# EAGLE design SCS (EAGLE 7.2.0)
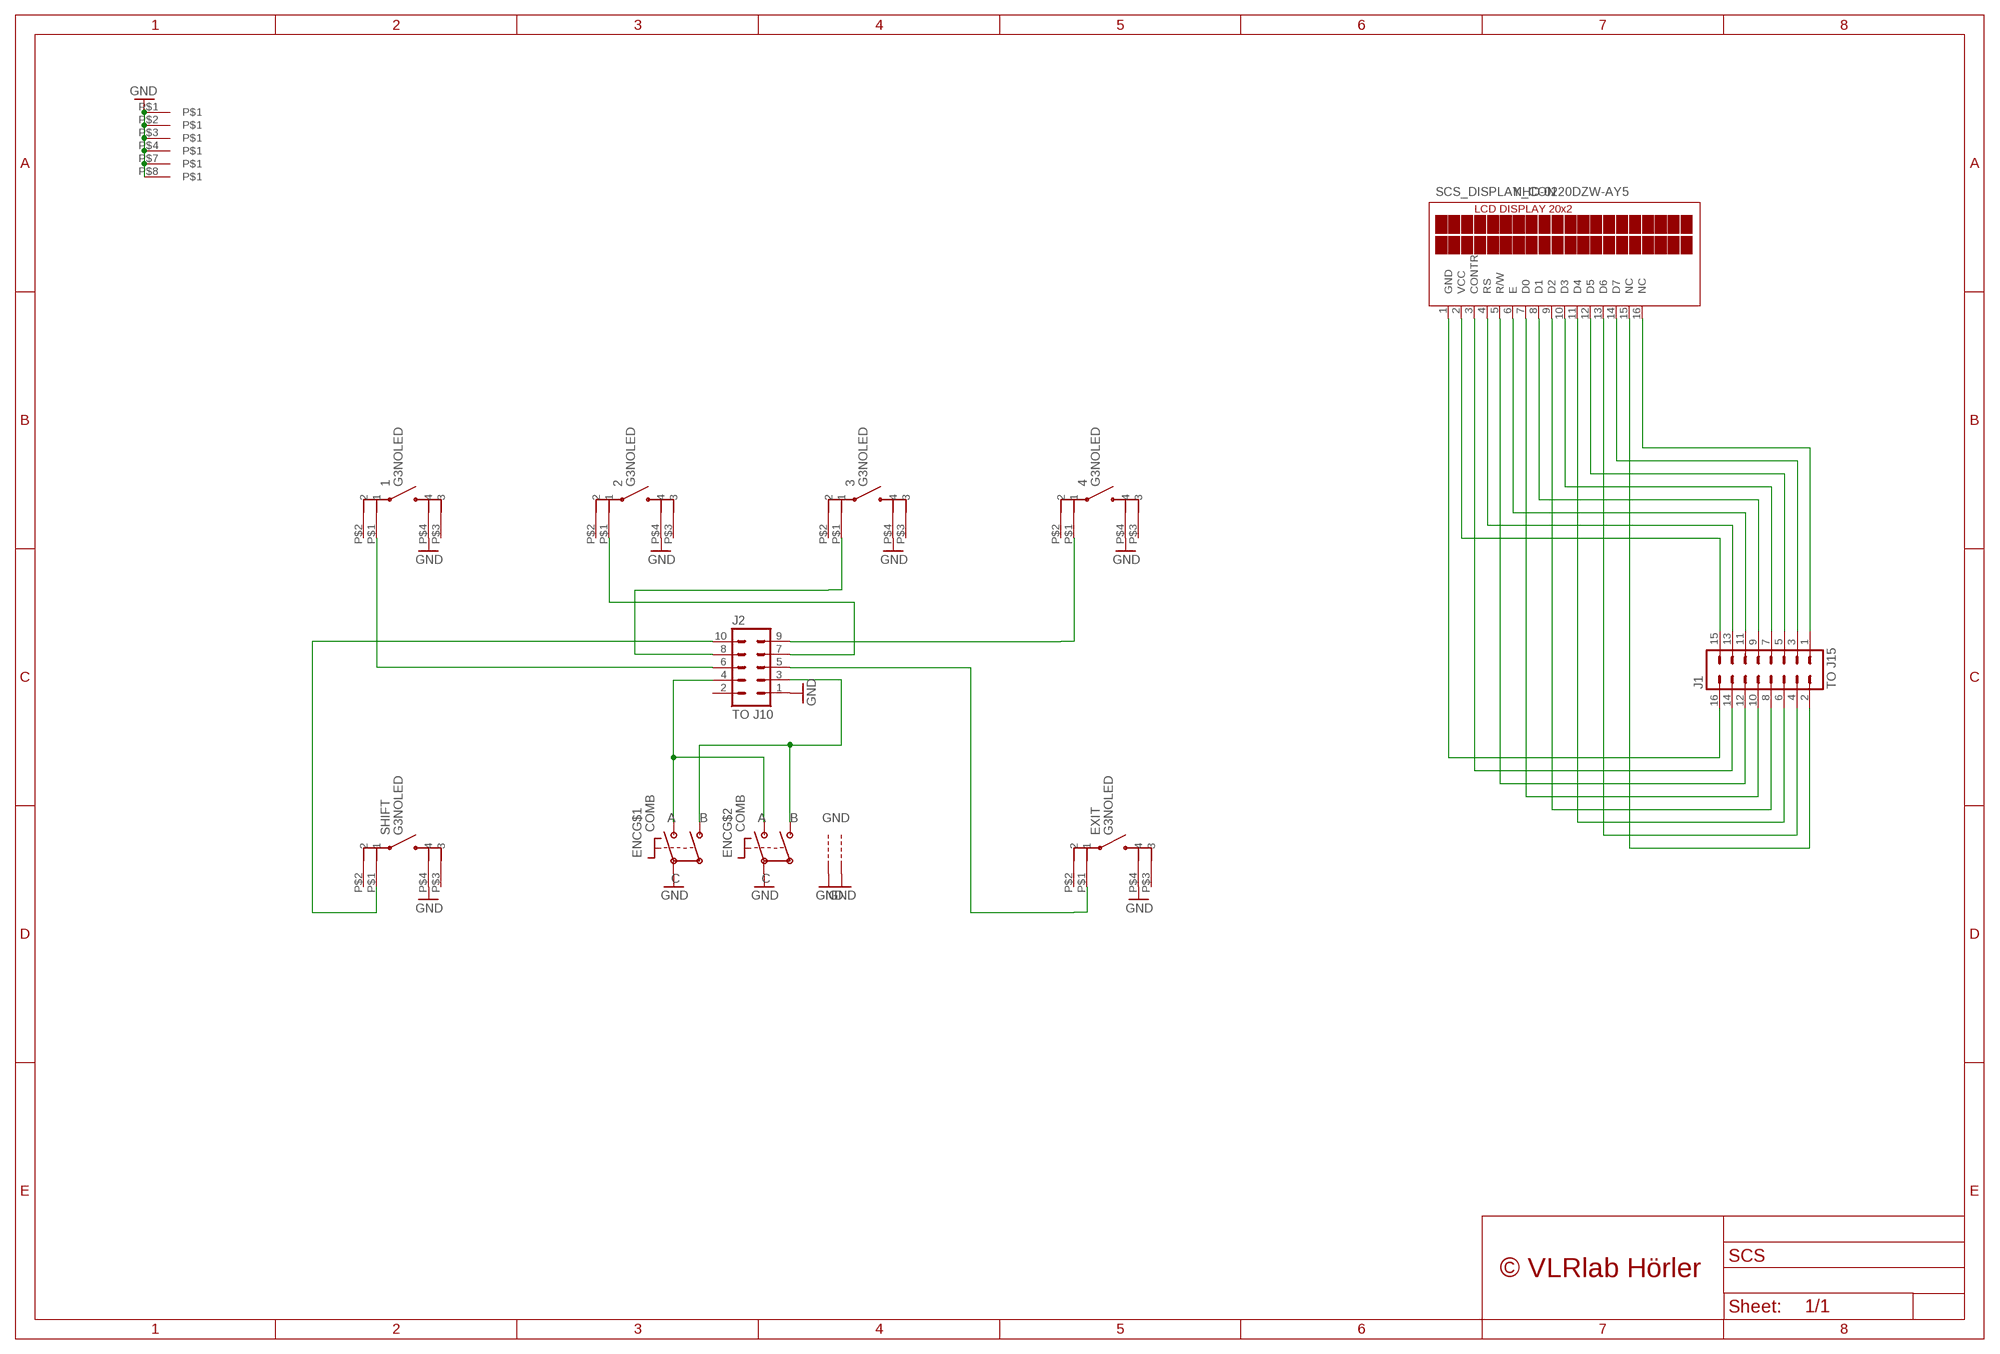
[diagram p0: schematic, sheet 1]

## Parts
1  G3NOLED  [G3NOLED]
2  G3NOLED  [G3NOLED]
3  G3NOLED  [G3NOLED]
4  G3NOLED  [G3NOLED]
ENC  COMB  [COMB_PEC11&STEC16]
EXIT  G3NOLED  [G3NOLED]
J1  TO J15  ML16  [ML16]
J2  TO J10  ML10  [ML10]
SCS_DISPLAY_CON  NHD-0220DZW-AY5  [NHD-0220DZW-AY5]
SHIFT  G3NOLED  [G3NOLED]
U$2  MIDIBOX_FULL  [MIDIBOX14X12]

## Nets
GND: 1.P$4 2.P$4 3.P$4 4.P$4 ENC.P$C ENC.P$C1(P$C) ENC.P$GND1 ENC.P$GND2 EXIT.P$4 J2.1 SHIFT.P$4 U$2.P$1 U$2.P$2 U$2.P$3 U$2.P$4 U$2.P$7 U$2.P$8
N$1: J1.16 SCS_DISPLAY_CON.1(GND)
N$2: J1.15 SCS_DISPLAY_CON.2(VCC)
N$3: J1.14 SCS_DISPLAY_CON.3(CONTR)
N$4: J1.13 SCS_DISPLAY_CON.4(RS)
N$5: J1.12 SCS_DISPLAY_CON.5(R/W)
N$6: J1.11 SCS_DISPLAY_CON.6(E)
N$7: J1.10 SCS_DISPLAY_CON.7(D0)
N$8: J1.9 SCS_DISPLAY_CON.8(D1)
N$9: J1.8 SCS_DISPLAY_CON.9(D2)
N$10: J1.7 SCS_DISPLAY_CON.10(D3)
N$11: J1.6 SCS_DISPLAY_CON.11(D4)
N$12: J1.5 SCS_DISPLAY_CON.12(D5)
N$13: J1.4 SCS_DISPLAY_CON.13(D6)
N$14: J1.3 SCS_DISPLAY_CON.14(D7)
N$15: J1.2 SCS_DISPLAY_CON.15(NC)
N$16: J1.1 SCS_DISPLAY_CON.16(NC)
N$17: 1.P$1 J2.6
N$18: J2.10 SHIFT.P$1
N$19: 2.P$1 J2.7
N$20: 3.P$1 J2.8
N$21: 4.P$1 J2.9
N$22: EXIT.P$1 J2.5
N$23: ENC.P$A ENC.P$A1(P$A) J2.4
N$25: ENC.P$B ENC.P$B1(P$B) J2.3
Unconnected: 1.P$2 1.P$3 2.P$2 2.P$3 3.P$2 3.P$3 4.P$2 4.P$3 EXIT.P$2 EXIT.P$3 J2.2 SHIFT.P$2 SHIFT.P$3

## Library data of the parts
1-4 EXIT SHIFT = Mec Switches:G3NOLED
ENC = encoder:COMB
J1 = con-ml:ML16: HARTING; OC_FARNELL: unknown; OC_NEWARK: unknown
J2 = con-ml:ML10: HARTING; OC_FARNELL: unknown; OC_NEWARK: unknown
SCS_DISPLAY_CON = newheaven display:NHD-0220DZW-AY5
U$2 = Frames_VLR:MIDIBOX_FULL

## Net classes
0 default: width 0.254 mm, drill 0.33 mm, clearance 0.254 mm

## Board
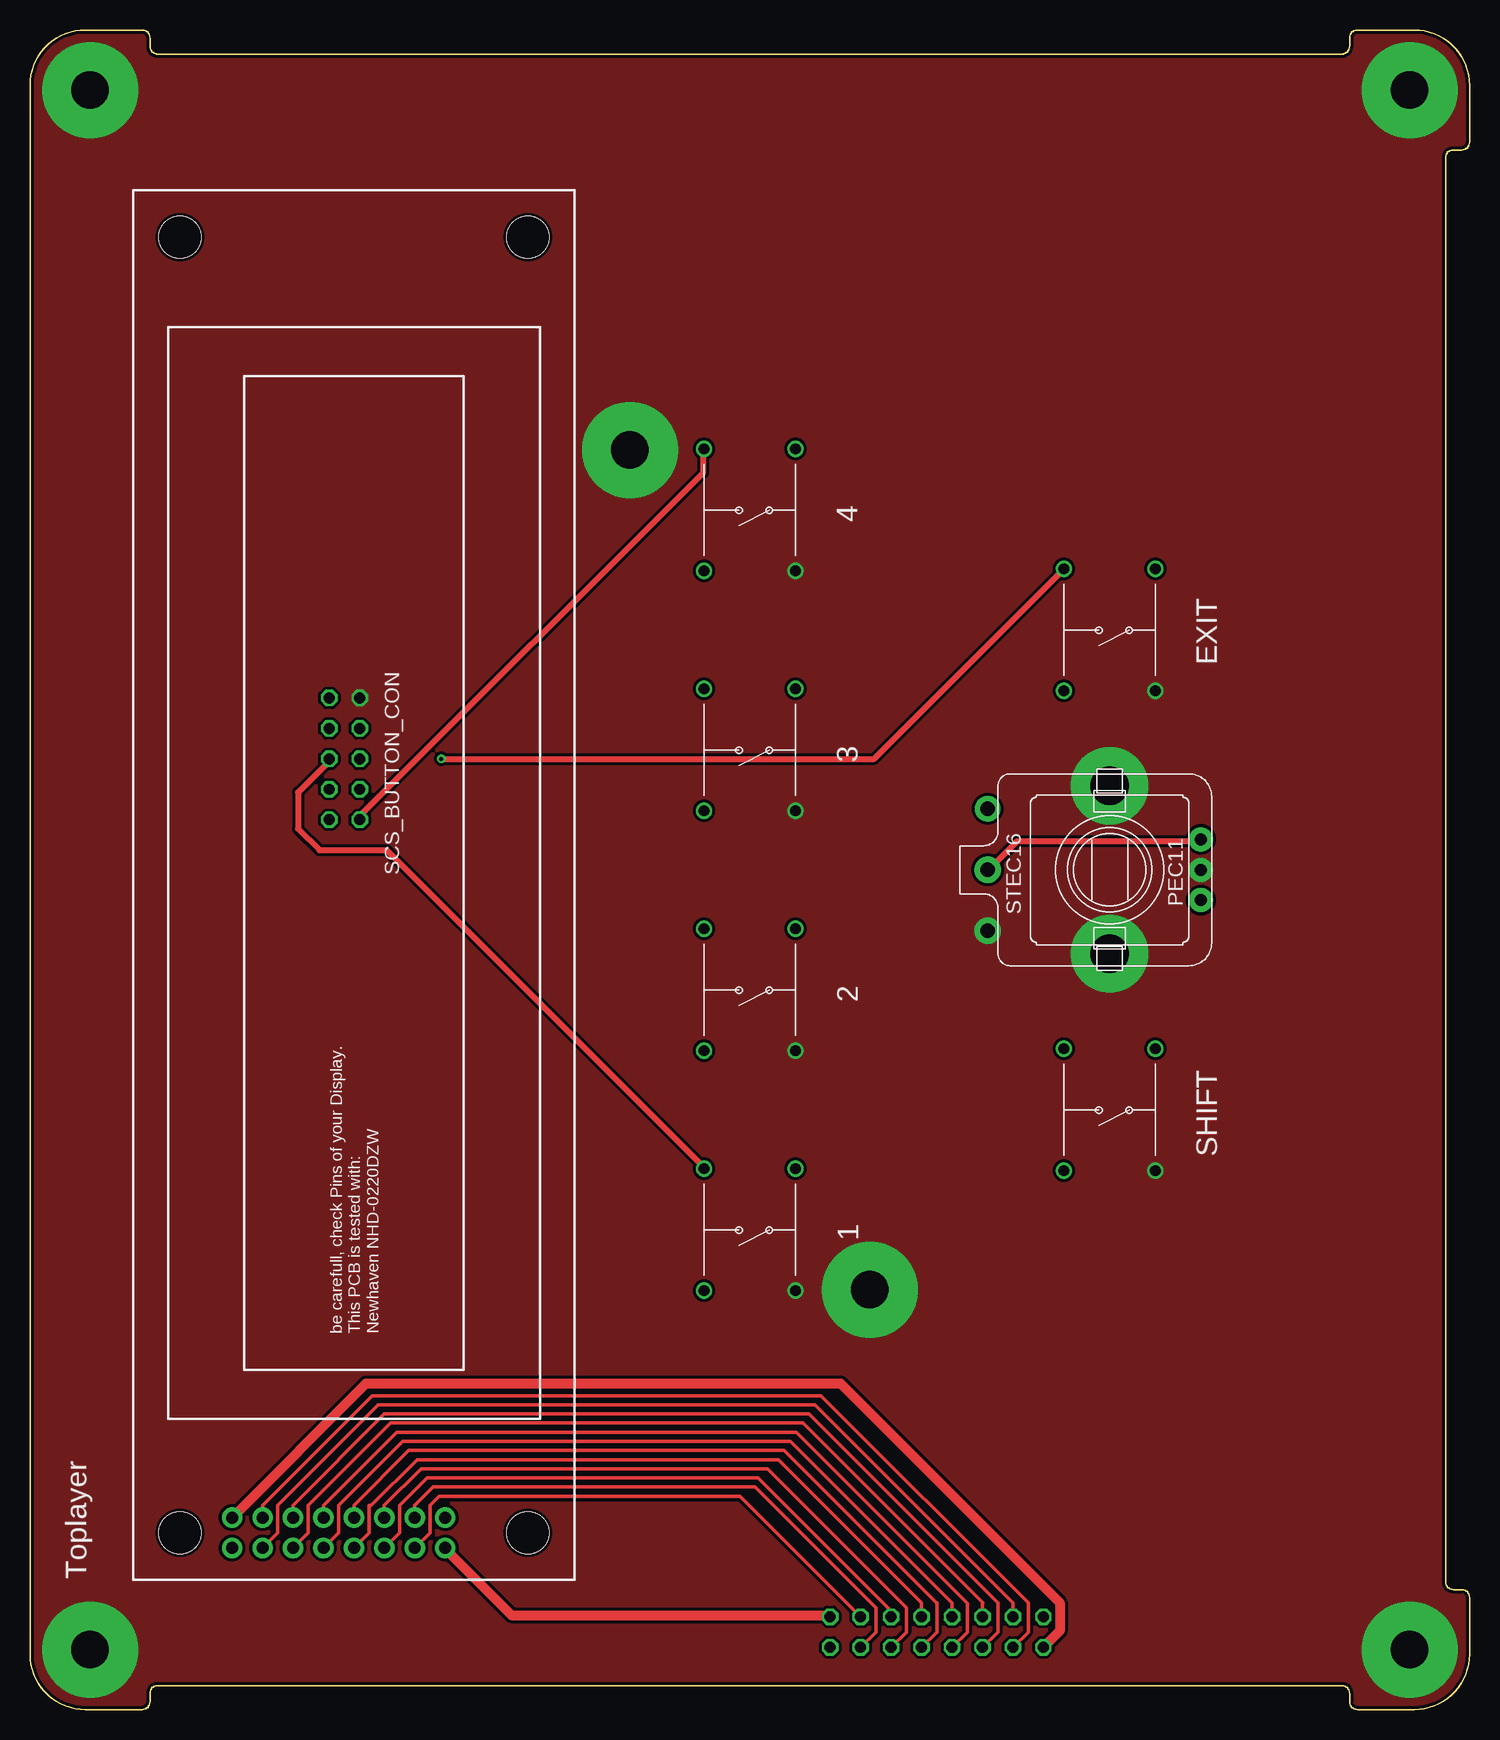
[diagram p1: board, top side]
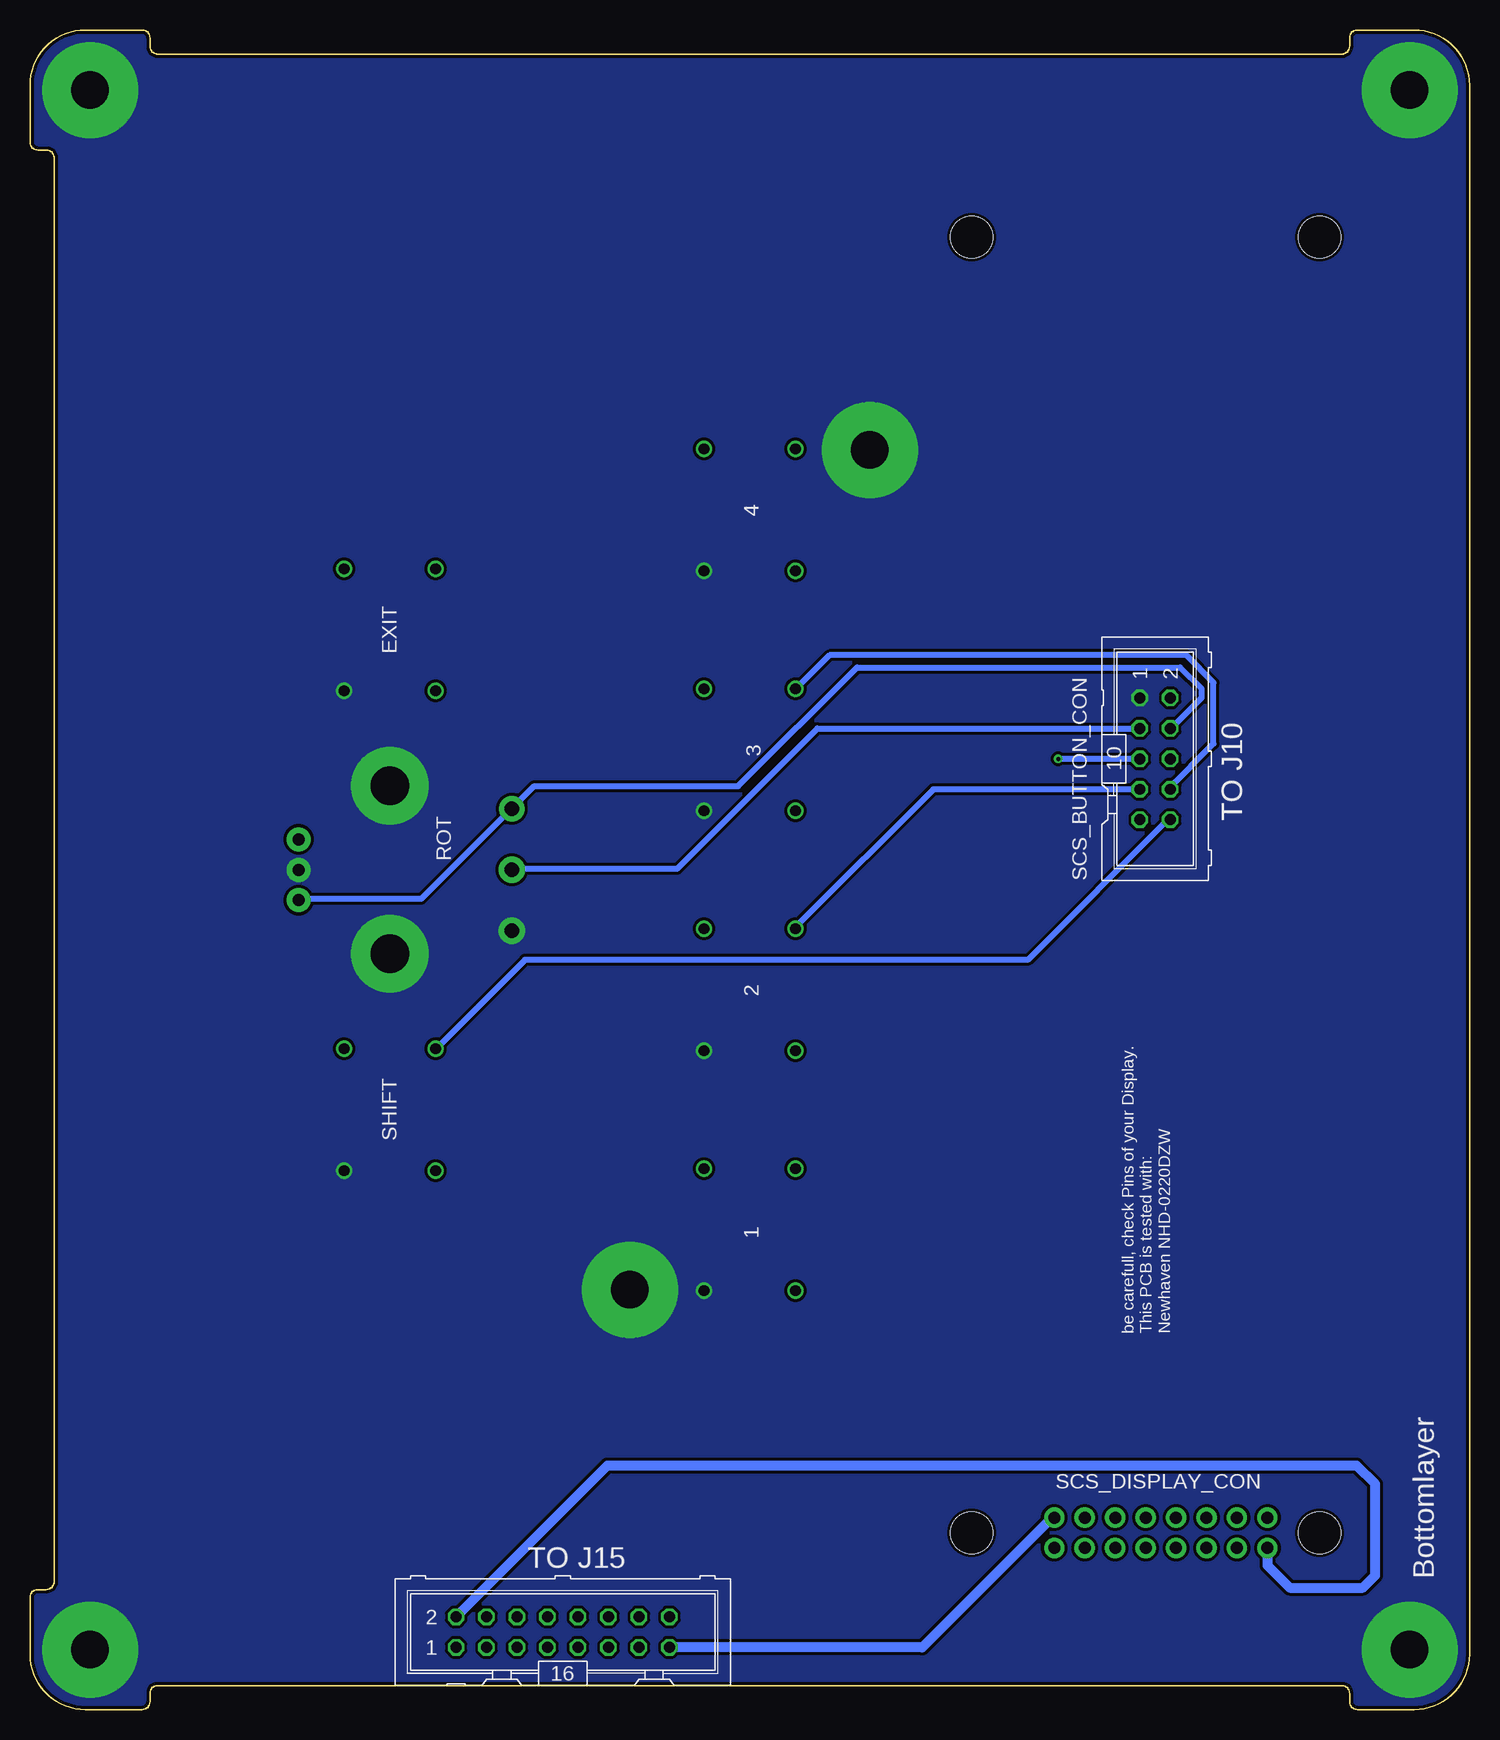
[diagram p2: board, bottom side, seen from below]

Size 120 x 140 mm. Coordinates in mm from the lower left corner, seen from the top.
Copper layers (1*16): Top 0.035mm / dielectric 1.5mm / Bottom 0.035mm
Design rules "default *": minimum track width 10mil, minimum drill 13mil, track to track 10mil, track to pad 10mil, pad to pad 10mil, via to via 8mil, smd to smd 8mil, copper to edge 10mil, drill to drill 8mil, minimum pad ring 8mil, minimum via ring 8mil, stop-mask expansion 4mil, vias tented up to drill 18mil, thermal gap 0mil

### Footprints (pad centres in the part's own frame; a part is rotated, then mirrored left to right if it is on the bottom)
G3NOLED = drill 0.9: P$1 5.08,3.81; P$2 -5.08,3.81; P$3 5.08,-3.81; P$4 -5.08,-3.81
COMB_PEC11&STEC16 = drill 1 pad 2: P$A -2.54,-7.62; P$B 2.54,-7.62; P$C 0,-7.62 | drill 1.2 pad 2.1: P$A1 5.08,10.16 | drill 1.2 pad 2.2: P$B1 0,10.16; P$C1 -5.08,10.16 | drill 3.2 pad 6.452: P$GND1 -6.985,0; P$GND2 6.985,0
ML16 = drill 0.914 octagon: 1 -8.89,-1.27; 2 -8.89,1.27; 3 -6.35,-1.27; 4 -6.35,1.27; 5 -3.81,-1.27; 6 -3.81,1.27; 7 -1.27,-1.27; 8 -1.27,1.27; 9 1.27,-1.27; 10 1.27,1.27; 11 3.81,-1.27; 12 3.81,1.27; 13 6.35,-1.27; 14 6.35,1.27; 15 8.89,-1.27; 16 8.89,1.27
ML10 = drill 0.914 octagon: 1 -5.08,-1.27; 2 -5.08,1.27; 3 -2.54,-1.27; 4 -2.54,1.27; 5 0,-1.27; 6 0,1.27; 7 2.54,-1.27; 8 2.54,1.27; 9 5.08,-1.27; 10 5.08,1.27
NHD-0220DZW-AY5 = drill 1 pad 1.676: 1 -56.54,-7.62; 2 -54,-7.62; 3 -56.54,-5.08; 4 -54,-5.08; 5 -56.54,-2.54; 6 -54,-2.54; 7 -56.54,0; 8 -54,0; 9 -56.54,2.54; 10 -54,2.54; 11 -56.54,5.08; 12 -54,5.08; 13 -56.54,7.62; 14 -54,7.62; 15 -56.54,10.16; 16 -54,10.16 | hole 3.5: -55.27,-14.5; 52.73,-14.5; -55.27,14.5; 52.73,14.5
MIDIBOX14X12 = drill 3.1 pad 8: P$1 5,135; P$2 50,105; P$3 70,35; P$4 5,5; P$7 115,135; P$8 115,5

### Placement (x,y rotation side)
1  60,40 90 top
2  60,60 90 top
3  60,80 90 top
4  60,100 90 top
ENC  90,70 90 top
EXIT  90,90 90 top
J1  75.59,6.45 0 bottom
J2  26.21,79.25 270 bottom
SCS_DISPLAY_CON  27,70 90 top
SHIFT  90,50 90 top
U$2  0,0 0 top
U$3  [(C)T.KLOSE]  102,108 90 top
U$4  [SCS]  88,103 90 bottom
U$5  [(C)T.KLOSE]  101,108 90 bottom
U$6  [VLRLAB]  110,103 90 bottom
U$11  [VLRLAB]  111,103 90 top
U$12  [SCS]  92,103 90 top

### Tracks (layer width: path | path; a pad name or v marks a point on that pad's centre or on a via)
GND
  pour Top: -47.28,152.74 149.13,153.74 148.13,-22.2 -46.28,-22.2
  pour Bottom: -47.28,151.74 149.13,153.74 148.13,-22.2 -46.28,-22.2
N$1
  Top 0.813: J1.16 66.55,7.87 40.13,7.87 35.56,12.45 35.03,12.98 34.62,13.44 SCS_DISPLAY_CON.1
N$2
  Bottom 0.254: 34.85,15.95 34.65,15.95 SCS_DISPLAY_CON.2
  Bottom 0.813: J1.15 45.62,5.18 34.85,15.95
N$3
  Top 0.305: SCS_DISPLAY_CON.3 33.35,14.73 33.35,17.02 34.11,17.78 59.18,17.78 J1.14
N$4
  Top 0.305: SCS_DISPLAY_CON.4 | SCS_DISPLAY_CON.4 32.08,17.02 33.6,18.54 59.18,18.54 60.45,18.54 69.85,9.14 70.51,8.48 70.51,6.45 J1.13
N$5
  Top 0.305: SCS_DISPLAY_CON.5 30.81,14.73 30.81,17.02 33.1,19.3 60.71,19.3 71.78,8.23 J1.12
N$6
  Top 0.305: SCS_DISPLAY_CON.6 | SCS_DISPLAY_CON.6 29.54,17.02 32.59,20.07 61.47,20.07 72.39,9.14 73.05,8.48 73.05,6.45 J1.11
N$7
  Top 0.305: SCS_DISPLAY_CON.7 28.27,14.73 28.27,17.02 28.45,17.02 32.26,20.83 62.41,20.83 74.32,8.91 J1.10
N$8
  Top 0.305: SCS_DISPLAY_CON.8 | SCS_DISPLAY_CON.8 27,17.02 | J1.9 75.59,6.45 75.59,8.89 75.56,8.91 62.87,21.61 31.57,21.59 27,17.02 | SCS_DISPLAY_CON.8 | SCS_DISPLAY_CON.8 27,17.02
N$9
  Top 0.305: SCS_DISPLAY_CON.9 25.73,14.73 25.73,17.02 31.06,22.35 63.4,22.35 76.86,8.89 J1.8
N$10
  Top 0.305: SCS_DISPLAY_CON.10 | J1.7 78.13,6.45 78.13,8.87 63.88,23.11 30.56,23.11 24.46,17.02 SCS_DISPLAY_CON.10
N$11
  Top 0.305: SCS_DISPLAY_CON.11 23.19,14.73 23.19,17.02 30.05,23.88 64.44,23.88 79.43,8.89 79.4,8.89 J1.6
N$12
  Top 0.305: SCS_DISPLAY_CON.12 | J1.5 80.67,6.45 80.67,8.89 64.92,24.64 29.54,24.64 21.92,17.02 SCS_DISPLAY_CON.12 | SCS_DISPLAY_CON.12
N$13
  Top 0.305: SCS_DISPLAY_CON.13 20.65,14.73 20.65,17.02 29.03,25.4 65.43,25.4 81.94,8.89 J1.4
N$14
  Top 0.305: SCS_DISPLAY_CON.14 | J1.3 83.21,6.45 83.21,8.89 65.94,26.16 28.52,26.16 19.38,17.02 SCS_DISPLAY_CON.14 | SCS_DISPLAY_CON.14
N$15
  Bottom 0.813: SCS_DISPLAY_CON.15 16.84,12.01 14.99,10.16 8.89,10.16 7.87,11.18 7.87,18.8 9.4,20.32 56.39,20.32 71.88,20.32 J1.2
N$16
  Top 0.305: SCS_DISPLAY_CON.16
  Top 0.813: SCS_DISPLAY_CON.16 28.02,27.18 67.56,27.18 85.85,8.89 85.85,6.55 J1.1
N$17
  Top 0.508: 1.P$1 56.13,45.21 29.72,71.63 24.13,71.63 22.35,73.41 22.35,76.45 25.15,79.25 J2.6
N$18
  Bottom 0.508: SHIFT.P$1 86.11,55.12 78.74,62.48 36.83,62.48 25.15,74.17 J2.10
N$19
  Bottom 0.508: 2.P$1 56.13,65.28 44.7,76.71 27.69,76.71 J2.7
N$20
  Bottom 0.508: 3.P$1 56.13,85.09 53.34,87.88 23.62,87.88 21.34,85.6 21.34,80.52 25.15,76.71 J2.8
N$21
  Top 0.508: 4.P$1 56.13,104.9 56.13,103.12 27.69,74.68 27.69,74.17 J2.9
N$22  (via drill 0.33)
  Top 0.508: v34.29,79.25 70.36,79.25 86.11,95 EXIT.P$1
  Bottom 0.508: v34.29,79.25 27.69,79.25 J2.5
N$23
  Bottom 0.508: J2.4 24.89,81.79 22.35,84.33 22.35,85.09 24.13,86.87 51.05,86.87 60.96,76.96 77.98,76.96 79.76,75.18 ENC.P$A1 80.01,74.93 87.38,67.56 97.54,67.56 ENC.P$A
N$25
  Top 0.508: ENC.P$B 97.54,72.39 82.3,72.39 80.01,70.1 ENC.P$B1
  Bottom 0.508: J2.3 27.69,81.79 54.36,81.79 66.04,70.1 79.76,70.1 ENC.P$B1

### Text on the board
tPlace: 4 | EXIT | 3 | 2 | SHIFT | 1 | Toplayer
bPlace: Bottomlayer
tNames: SCS_BUTTON_CON | be carefull, check Pins of your Display. / This PCB is tested with: / Newhaven NHD-0220DZW
bNames: SCS_BUTTON_CON | ROT | be carefull, check Pins of your Display. / This PCB is tested with: / Newhaven NHD-0220DZW
Reference: mount Display and Keys this side | mount Sockets J10 & J15 this side | SCS Display